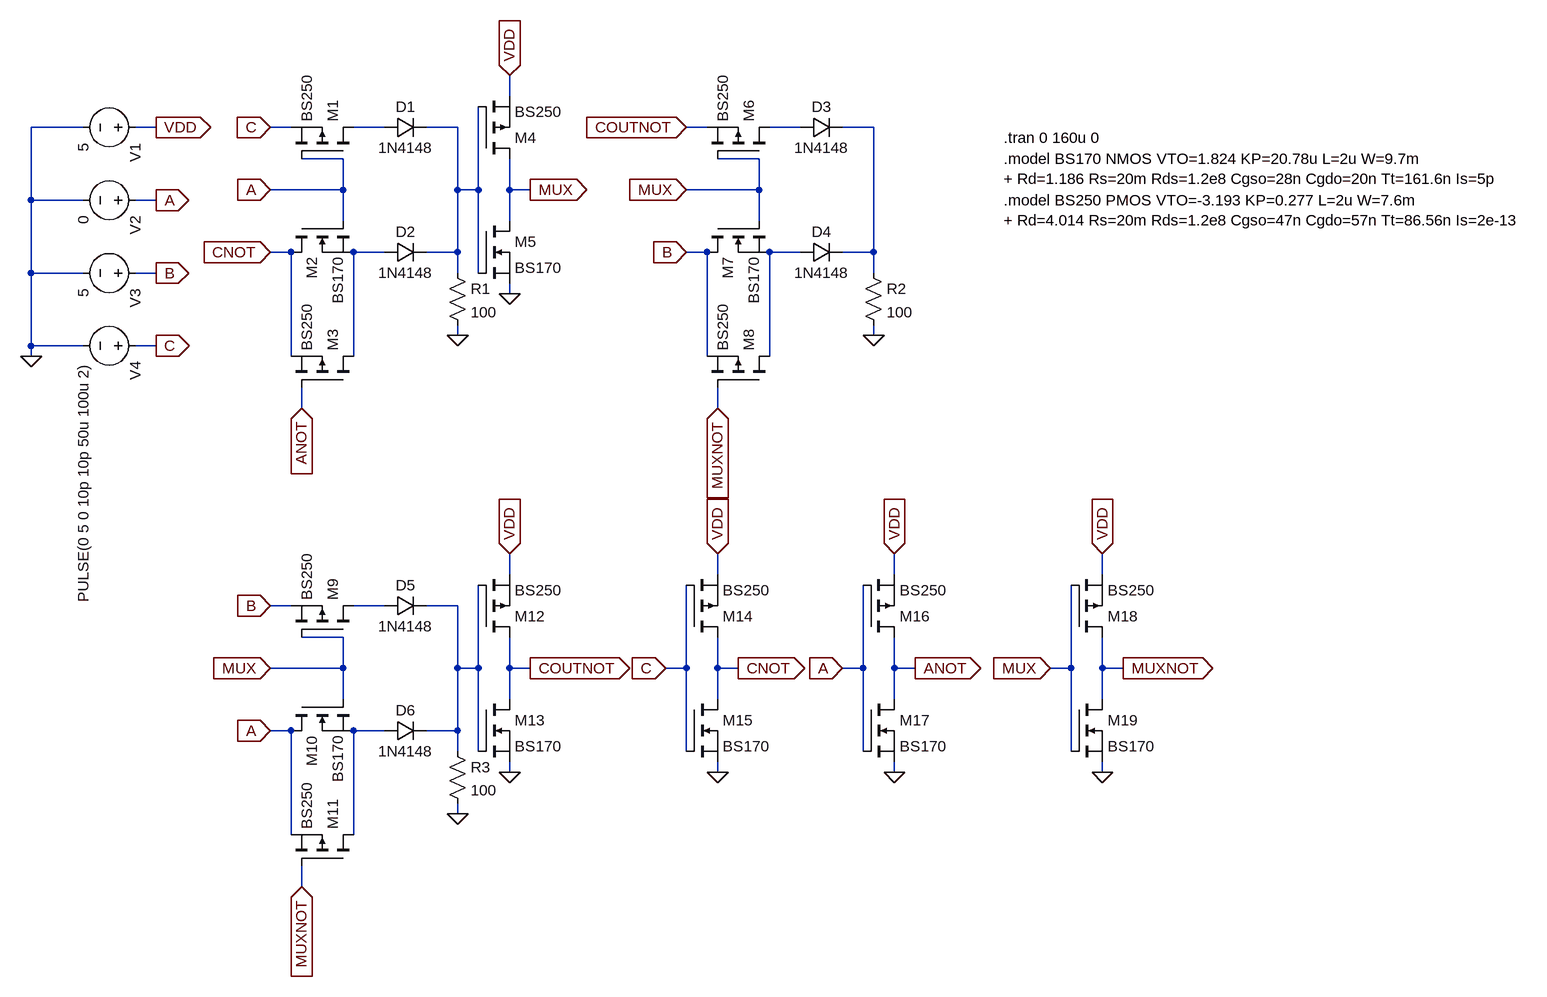
[diagram p0: schematic FullAdderDesign1.asc]
FullAdderDesign1.asc, the LTspice schematic file:
Version 4
SHEET 1 2196 1204
WIRE 368 -176 368 -208
WIRE -288 -128 -368 -128
WIRE -176 -128 -208 -128
WIRE 32 -128 0 -128
WIRE 176 -128 128 -128
WIRE 288 -128 240 -128
WIRE 672 -128 640 -128
WIRE 816 -128 768 -128
WIRE 928 -128 880 -128
WIRE 112 -80 48 -80
WIRE 752 -80 688 -80
WIRE 112 -32 112 -80
WIRE 112 -32 0 -32
WIRE 288 -32 288 -128
WIRE 320 -32 320 -160
WIRE 320 -32 288 -32
WIRE 368 -32 368 -80
WIRE 400 -32 368 -32
WIRE 752 -32 752 -80
WIRE 752 -32 640 -32
WIRE -368 -16 -368 -128
WIRE -288 -16 -368 -16
WIRE -176 -16 -208 -16
WIRE 112 16 112 -32
WIRE 368 16 368 -32
WIRE 752 16 752 -32
WIRE 32 64 0 64
WIRE 176 64 128 64
WIRE 288 64 288 -32
WIRE 288 64 240 64
WIRE 672 64 640 64
WIRE 816 64 768 64
WIRE 928 64 928 -128
WIRE 928 64 880 64
WIRE -368 96 -368 -16
WIRE -288 96 -368 96
WIRE -176 96 -208 96
WIRE 288 96 288 64
WIRE 320 96 320 -32
WIRE 928 96 928 64
WIRE 368 128 368 112
WIRE 288 192 288 176
WIRE 928 192 928 176
WIRE -368 208 -368 96
WIRE -288 208 -368 208
WIRE -176 208 -208 208
WIRE -368 224 -368 208
WIRE 32 224 32 64
WIRE 128 224 128 64
WIRE 672 224 672 64
WIRE 768 224 768 64
WIRE 48 304 48 272
WIRE 688 304 688 272
WIRE 368 560 368 528
WIRE 688 560 688 528
WIRE 960 560 960 528
WIRE 1280 560 1280 528
WIRE 32 608 0 608
WIRE 176 608 128 608
WIRE 288 608 240 608
WIRE 112 656 48 656
WIRE 112 704 112 656
WIRE 112 704 0 704
WIRE 288 704 288 608
WIRE 320 704 320 576
WIRE 320 704 288 704
WIRE 368 704 368 656
WIRE 400 704 368 704
WIRE 640 704 640 576
WIRE 640 704 608 704
WIRE 688 704 688 656
WIRE 720 704 688 704
WIRE 912 704 912 576
WIRE 912 704 880 704
WIRE 960 704 960 656
WIRE 992 704 960 704
WIRE 1232 704 1232 576
WIRE 1232 704 1200 704
WIRE 1280 704 1280 656
WIRE 1312 704 1280 704
WIRE 112 752 112 704
WIRE 368 752 368 704
WIRE 688 752 688 704
WIRE 960 752 960 704
WIRE 1280 752 1280 704
WIRE 32 800 0 800
WIRE 176 800 128 800
WIRE 288 800 288 704
WIRE 288 800 240 800
WIRE 288 832 288 800
WIRE 320 832 320 704
WIRE 640 832 640 704
WIRE 912 832 912 704
WIRE 1232 832 1232 704
WIRE 368 864 368 848
WIRE 688 864 688 848
WIRE 960 864 960 848
WIRE 1280 864 1280 848
WIRE 288 928 288 912
WIRE 32 960 32 800
WIRE 128 960 128 800
WIRE 48 1040 48 1008
FLAG 0 -128 C
IOPIN 0 -128 In
FLAG 0 -32 A
IOPIN 0 -32 In
FLAG 0 64 CNOT
IOPIN 0 64 In
FLAG 368 128 0
FLAG 400 -32 MUX
IOPIN 400 -32 Out
FLAG 688 864 0
FLAG 720 704 CNOT
IOPIN 720 704 Out
FLAG 960 864 0
FLAG 992 704 ANOT
IOPIN 992 704 Out
FLAG 1280 864 0
FLAG 1312 704 MUXNOT
IOPIN 1312 704 Out
FLAG 608 704 C
IOPIN 608 704 In
FLAG 880 704 A
IOPIN 880 704 In
FLAG 1200 704 MUX
IOPIN 1200 704 In
FLAG 0 608 B
IOPIN 0 608 In
FLAG 0 704 MUX
IOPIN 0 704 In
FLAG 0 800 A
IOPIN 0 800 In
FLAG 368 864 0
FLAG 400 704 COUTNOT
IOPIN 400 704 Out
FLAG 640 -128 COUTNOT
IOPIN 640 -128 In
FLAG 640 -32 MUX
IOPIN 640 -32 In
FLAG 640 64 B
IOPIN 640 64 In
FLAG 368 -208 VDD
IOPIN 368 -208 In
FLAG 688 528 VDD
IOPIN 688 528 In
FLAG 960 528 VDD
IOPIN 960 528 In
FLAG 1280 528 VDD
IOPIN 1280 528 In
FLAG 368 528 VDD
IOPIN 368 528 In
FLAG 288 192 0
FLAG 928 192 0
FLAG 288 928 0
FLAG 48 304 ANOT
IOPIN 48 304 In
FLAG 48 1040 MUXNOT
IOPIN 48 1040 In
FLAG 688 304 MUXNOT
IOPIN 688 304 In
FLAG -176 -16 A
IOPIN -176 -16 Out
FLAG -176 96 B
IOPIN -176 96 Out
FLAG -176 208 C
IOPIN -176 208 Out
FLAG -176 -128 VDD
IOPIN -176 -128 Out
FLAG -368 224 0
SYMBOL pmos 128 -80 M270
SYMATTR InstName M1
SYMATTR Value BS250
SYMBOL nmos 32 16 M90
SYMATTR InstName M2
SYMATTR Value BS170
SYMBOL nmos 320 16 R0
SYMATTR InstName M5
SYMATTR Value BS170
SYMBOL pmos 320 -80 M180
SYMATTR InstName M4
SYMATTR Value BS250
SYMBOL nmos 640 752 R0
SYMATTR InstName M15
SYMATTR Value BS170
SYMBOL pmos 640 656 M180
SYMATTR InstName M14
SYMATTR Value BS250
SYMBOL nmos 912 752 R0
SYMATTR InstName M17
SYMATTR Value BS170
SYMBOL pmos 912 656 M180
SYMATTR InstName M16
SYMATTR Value BS250
SYMBOL nmos 1232 752 R0
SYMATTR InstName M19
SYMATTR Value BS170
SYMBOL pmos 1232 656 M180
SYMATTR InstName M18
SYMATTR Value BS250
SYMBOL pmos 128 656 M270
SYMATTR InstName M9
SYMATTR Value BS250
SYMBOL nmos 32 752 M90
SYMATTR InstName M10
SYMATTR Value BS170
SYMBOL nmos 320 752 R0
SYMATTR InstName M13
SYMATTR Value BS170
SYMBOL pmos 320 656 M180
SYMATTR InstName M12
SYMATTR Value BS250
SYMBOL pmos 768 -80 M270
SYMATTR InstName M6
SYMATTR Value BS250
SYMBOL nmos 672 16 M90
SYMATTR InstName M7
SYMATTR Value BS170
SYMBOL diode 176 -112 R270
WINDOW 0 32 32 VTop 2
WINDOW 3 0 32 VBottom 2
SYMATTR InstName D1
SYMATTR Value 1N4148
SYMBOL diode 176 80 R270
WINDOW 0 32 32 VTop 2
WINDOW 3 0 32 VBottom 2
SYMATTR InstName D2
SYMATTR Value 1N4148
SYMBOL diode 816 -112 R270
WINDOW 0 32 32 VTop 2
WINDOW 3 0 32 VBottom 2
SYMATTR InstName D3
SYMATTR Value 1N4148
SYMBOL diode 816 80 R270
WINDOW 0 32 32 VTop 2
WINDOW 3 0 32 VBottom 2
SYMATTR InstName D4
SYMATTR Value 1N4148
SYMBOL diode 176 624 R270
WINDOW 0 32 32 VTop 2
WINDOW 3 0 32 VBottom 2
SYMATTR InstName D5
SYMATTR Value 1N4148
SYMBOL diode 176 816 R270
WINDOW 0 32 32 VTop 2
WINDOW 3 0 32 VBottom 2
SYMATTR InstName D6
SYMATTR Value 1N4148
SYMBOL res 272 80 R0
SYMATTR InstName R1
SYMATTR Value 100
SYMBOL res 912 80 R0
SYMATTR InstName R2
SYMATTR Value 100
SYMBOL res 272 816 R0
SYMATTR InstName R3
SYMATTR Value 100
SYMBOL pmos 128 272 M270
SYMATTR InstName M3
SYMATTR Value BS250
SYMBOL pmos 128 1008 M270
SYMATTR InstName M11
SYMATTR Value BS250
SYMBOL pmos 768 272 M270
SYMATTR InstName M8
SYMATTR Value BS250
SYMBOL voltage -192 -16 R90
WINDOW 123 0 0 Left 0
WINDOW 39 0 0 Left 0
SYMATTR InstName V2
SYMATTR Value 0
SYMBOL voltage -192 96 R90
WINDOW 123 0 0 Left 0
WINDOW 39 0 0 Left 0
SYMATTR InstName V3
SYMATTR Value 5
SYMBOL voltage -192 208 R90
WINDOW 123 0 0 Left 0
WINDOW 39 0 0 Left 0
SYMATTR InstName V4
SYMATTR Value PULSE(0 5 0 10p 10p 50u 100u 2)
SYMBOL voltage -192 -128 R90
WINDOW 123 0 0 Left 0
WINDOW 39 0 0 Left 0
SYMATTR InstName V1
SYMATTR Value 5
TEXT 1128 -112 Left 2 !.tran 0 160u 0
TEXT 1128 -80 Left 2 !.model BS170 NMOS VTO=1.824 KP=20.78u L=2u W=9.7m\n+ Rd=1.186 Rs=20m Rds=1.2e8 Cgso=28n Cgdo=20n Tt=161.6n Is=5p
TEXT 1128 -16 Left 2 !.model BS250 PMOS VTO=-3.193 KP=0.277 L=2u W=7.6m\n+ Rd=4.014 Rs=20m Rds=1.2e8 Cgso=47n Cgdo=57n Tt=86.56n Is=2e-13

The netlist it stands for:
* FullAdderDesign1.asc
M1 N001 A C C BS250
M2 CNOT A N005 N005 BS170
M5 MUX N002 0 0 BS170
M4 MUX N002 VDD VDD BS250
M15 CNOT C 0 0 BS170
M14 CNOT C VDD VDD BS250
M17 ANOT A 0 0 BS170
M16 ANOT A VDD VDD BS250
M19 MUXNOT MUX 0 0 BS170
M18 MUXNOT MUX VDD VDD BS250
M9 N007 MUX B B BS250
M10 A MUX N009 N009 BS170
M13 COUTNOT N008 0 0 BS170
M12 COUTNOT N008 VDD VDD BS250
M6 N003 MUX COUTNOT COUTNOT BS250
M7 B MUX N006 N006 BS170
D1 N001 N002 1N4148
D2 N005 N002 1N4148
D3 N003 N004 1N4148
D4 N006 N004 1N4148
D5 N007 N008 1N4148
D6 N009 N008 1N4148
R1 N002 0 100
R2 N004 0 100
R3 N008 0 100
M3 N005 ANOT CNOT CNOT BS250
M11 N009 MUXNOT A A BS250
M8 N006 MUXNOT B B BS250
V2 A 0 0
V3 B 0 5
V4 C 0 PULSE(0 5 0 10p 10p 50u 100u 2)
V1 VDD 0 5
.model D D
.lib standard.dio
.model NMOS NMOS
.model PMOS PMOS
.lib standard.mos
.tran 0 160u 0
.model BS170 NMOS VTO=1.824 KP=20.78u L=2u W=9.7m
+ Rd=1.186 Rs=20m Rds=1.2e8 Cgso=28n Cgdo=20n Tt=161.6n Is=5p
.model BS250 PMOS VTO=-3.193 KP=0.277 L=2u W=7.6m
+ Rd=4.014 Rs=20m Rds=1.2e8 Cgso=47n Cgdo=57n Tt=86.56n Is=2e-13
.backanno
.end